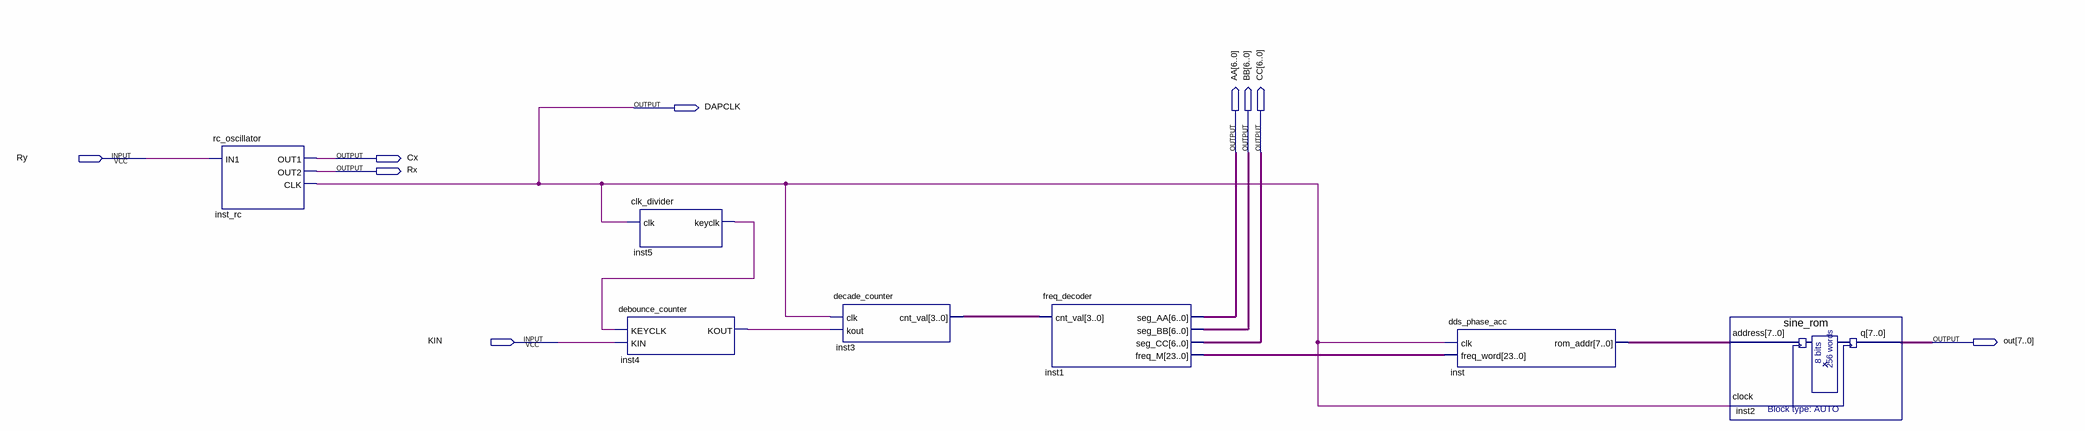
[diagram p0: schematic sheet]
// Quartus schematic changable.bdf as structural Verilog: 7 symbols, 9 pins
module changable (
  input  Ry,
  input  KIN,
  output DAPCLK,
  output [6:0] AA,
  output [6:0] BB,
  output [6:0] CC,
  output Cx,
  output Rx,
  output [7:0] out
);

  wire inst4_kout, inst5_keyclk;
  wire [3:0] inst3_cnt_val;
  wire [7:0] inst_rom_addr;
  wire [23:0] inst1_freq_m;

  rc_oscillator inst_rc (.IN1(Ry), .OUT1(Cx), .OUT2(Rx), .CLK(DAPCLK));
  clk_divider inst5 (.clk(DAPCLK), .keyclk(inst5_keyclk));
  debounce_counter inst4 (.KEYCLK(inst5_keyclk), .KIN(KIN), .KOUT(inst4_kout));
  decade_counter inst3 (.clk(DAPCLK), .kout(inst4_kout), .cnt_val(inst3_cnt_val));
  freq_decoder inst1 (.cnt_val(inst3_cnt_val), .seg_AA(AA), .seg_BB(BB), .seg_CC(CC), .freq_M(inst1_freq_m));
  dds_phase_acc inst (.clk(DAPCLK), .freq_word(inst1_freq_m), .rom_addr(inst_rom_addr));
  sine_rom inst2 (.address(inst_rom_addr), .clock(DAPCLK), .q(out));
endmodule
